# Altium schematic sheet Electrochemical_sensors.SchDoc
size A4
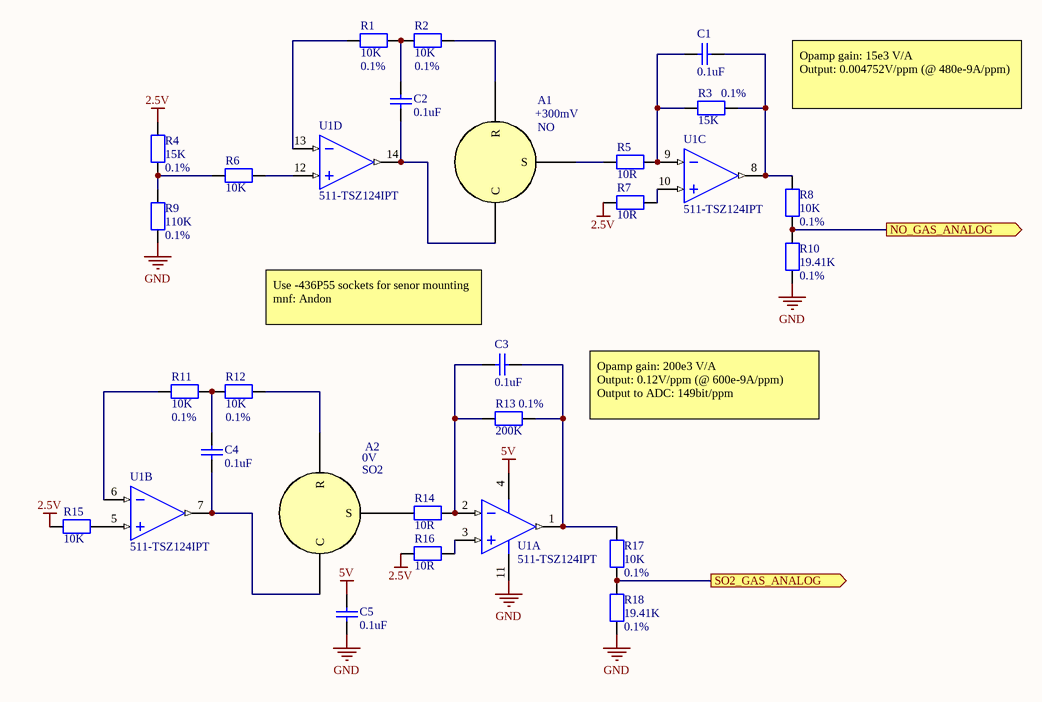
[diagram p0: Electrochemical_sensors.SchDoc]

## Parts
A1  Gas_type: NO  Potential: +300mV  [Electrochemical]  (hidden comment: Electrochemical sensors)
A2  Gas_type: SO2  Ptential: 0V  [Electrochemical]  (hidden comment: Electrochemical sensors)
C1  value 0.1uF  [0603_CAP]  (hidden comment: Capacitor)
C2  value 0.1uF  [0603_CAP]  (hidden comment: Capacitor)
C3  value 0.1uF  [0603_CAP]  (hidden comment: Capacitor)
C4  value 0.1uF  [0603_CAP]  (hidden comment: Capacitor)
C5  value 0.1uF  [0603_CAP]  (hidden comment: Capacitor)
R1  value 10K  Accuracy: 0.1%  [0603_RES]  (hidden comment: Resitor)
R2  value 10K  Accuracy: 0.1%  [0603_RES]  (hidden comment: Resitor)
R3  value 15K  Accuracy: 0.1%  [0603_RES]  (hidden comment: Resitor)
R4  value 15K  Accuracy: 0.1%  [0603_RES]  (hidden comment: Resitor)
R5  value 10R  [0603_RES]  (hidden comment: Resitor)
R6  value 10K  [0603_RES]  (hidden comment: Resitor)
R7  value 10R  [0603_RES]  (hidden comment: Resitor)
R8  value 10K  Accuracy: 0.1%  [0603_RES]  (hidden comment: Resitor)
R9  value 110K  Accuracy: 0.1%  [0603_RES]  (hidden comment: Resitor)
R10  value 19.41K  Accuracy: 0.1%  [0603_RES]  (hidden comment: Resitor)
R11  value 10K  Accuracy: 0.1%  [0603_RES]  (hidden comment: Resitor)
R12  value 10K  Accuracy: 0.1%  [0603_RES]  (hidden comment: Resitor)
R13  value 200K  Accuracy: 0.1%  [0603_RES]  (hidden comment: Resitor)
R14  value 10R  [0603_RES]  (hidden comment: Resitor)
R15  value 10K  [0603_RES]  (hidden comment: Resitor)
R16  value 10R  [0603_RES]  (hidden comment: Resitor)
R17  value 10K  Accuracy: 0.1%  [0603_RES]  (hidden comment: Resitor)
R18  value 19.41K  Accuracy: 0.1%  [0603_RES]  (hidden comment: Resitor)
U1  Supplier Part Number 1: 511-TSZ124IPT  [TSOP65P640X120-14M]  (hidden comment: TSZ124)  (parts A,B,C,D of 4)

## Ports
NO_GAS_ANALOG (out), SO2_GAS_ANALOG (out)

## Nets
2.5V: R4.2 R7.1 R15.1 R16.1
5V: C5.2 U1.4(V+)
GND: C5.1 R9.1 R10.1 R18.1 U1.11(V-)
NO_GAS_ANALOG: R8.1 R10.2 ; port NO_GAS_ANALOG
SO2_GAS_ANALOG: R17.1 R18.2 ; port SO2_GAS_ANALOG
NetA1_C: A1.C C2.1 U1.14(OUT4)
NetA1_R: A1.R R2.1
NetA1_S: A1.S R5.1
NetA2_C: A2.C C4.1 U1.7(OUT2)
NetA2_R: A2.R R12.1
NetA2_S: A2.S R14.1
NetC1_1: C1.1 R3.1 R8.2 U1.8(OUT3)
NetC1_2: C1.2 R3.2 R5.2 U1.9(IN3-)
NetC2_2: C2.2 R1.1 R2.2
NetC3_1: C3.1 R13.1 R17.2 U1.1(OUT1)
NetC3_2: C3.2 R13.2 R14.2 U1.2(IN1-)
NetC4_2: C4.2 R11.1 R12.2
NetR1_2: R1.2 U1.13(IN4-)
NetR4_1: R4.1 R6.1 R9.2
NetR6_2: R6.2 U1.12(IN4+)
NetR7_2: R7.2 U1.10(IN3+)
NetR11_2: R11.2 U1.6(IN2-)
NetR15_2: R15.2 U1.5(IN2+)
NetR16_2: R16.2 U1.3(IN1+)

## Notes on the sheet
- Opamp gain: 15e3 V/A
  Output: 0.004752V/ppm (@ 480e-9A/ppm)
- (near C3) Use -436P55 sockets for senor mounting
  mnf: Andon
- Opamp gain: 200e3 V/A
  Output: 0.12V/ppm (@ 600e-9A/ppm)
  Output to ADC: 149bit/ppm

## Library data of the parts
A1 = Electrochemical_sensor: Max_sensetivity: 250ppm
A2 = Electrochemical_sensor: Max_sensetivity: 20ppm
C1-C5 = Capacitor: Max_V: 25V
U1 = TSZ124: Supplier 1: Mouser